# EasyEDA Pro project Temp_Con_V116.eprj, board TC_485
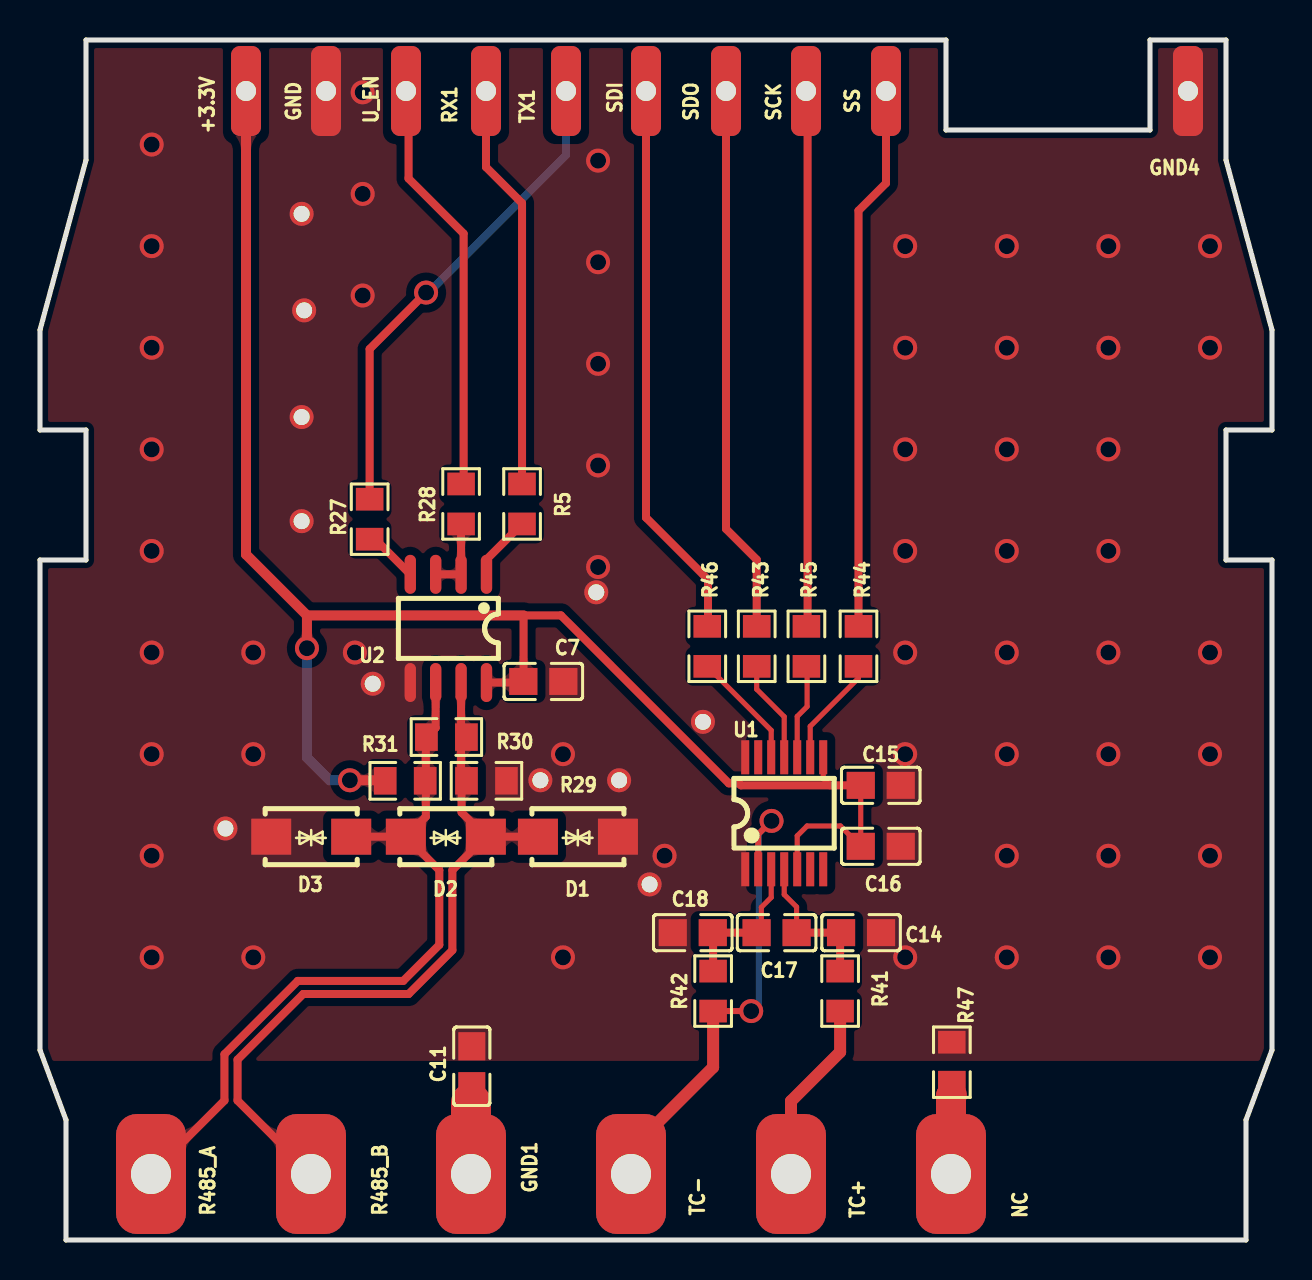
[diagram p12: board, top side]
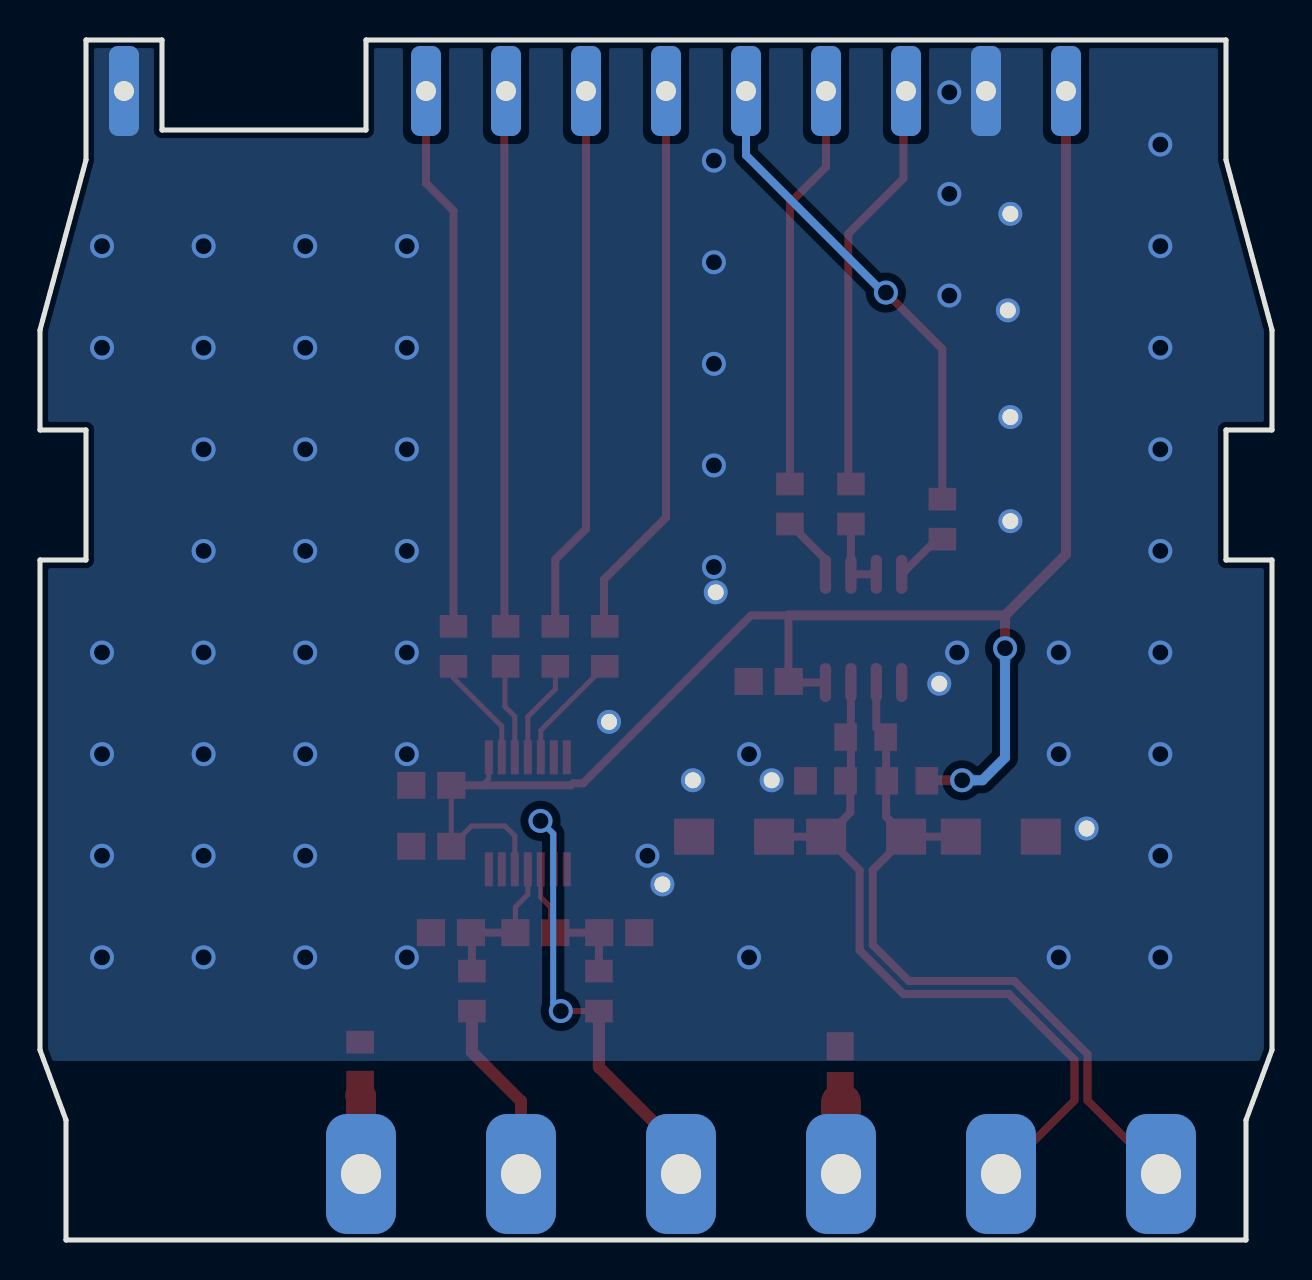
[diagram p13: board, bottom side, seen from below]

Outline 61.6 x 60 mm; copper layers: Top Layer, Bottom Layer. Coordinates in mm from the lower left corner of the outline.
Outline path: 0,45.5 0,40.5 2.3,40.5 2.3,34 0,34 0,9.5 1.3,6 1.3,0 60.3,0 60.3,6 61.6,9.5 61.6,34 59.3,34 59.3,40.5 61.6,40.5 61.6,45.5 59.3,54 59.3,60 55.5,60 55.5,55.5 45.3,55.5 45.3,60 2.3,60 2.3,54 0,45.5
Stack: Top Layer 0.035mm / Dielectric1 1.51mm FR4 er 4.5 / Bottom Layer 0.035mm

## Design rules (mm)
net R485_B: DP1
net R485_A: DP1
template: Custom Config
spacing copperThickness1oz (default): track to track 0.254, other pairs 0.203 to 0.305
spacing copperThickness2oz: track to track 0.203, other pairs 0.152 to 0.3
track width copperThickness1oz (default): min 0.127, default 0.254, max 2.54
track width copperThickness2oz: min 0.203, default 0.254, max 2.54
differential pair differentialPair (default): width min 0.254, default 0.4, max 2.54; gap min 0.254, default 0.254
via viaSize (default): diameter min 0.5, default 1.2, max 10; hole min 0.3, default 0.8, max 6.299

## Placement (name value [footprint] x y rotation side)
+3.3V  -  [S_FT]  10.3 57.45 0 top
C7  100nF  [C0805]  25.17 27.93 180 top
C11  1nF  [C0805]  21.59 8.69 90 top
C14  10nF  [C0805]  41.05 15.37 180 top
C15  100nF  [C0805]  42.04 22.73 0 top
C16  100nF  [C0805]  42.04 19.69 0 top
C17  100nF  [C0805]  36.83 15.37 180 top
C18  10nF  [C0805]  32.64 15.37 0 top
D1  SMAJ12CA  [SMA_L4.4-W2.6-LS5.0-BI]  26.9 20.17 0 top
D2  SMAJ12CA  [SMA_L4.4-W2.6-LS5.0-BI]  20.29 20.17 0 top
D3  SMAJ12CA  [SMA_L4.4-W2.6-LS5.0-BI]  13.56 20.17 0 top
GND  -  [S_FT]  14.3 57.45 0 top
GND1  -  [B_FT]  21.55 3.3 180 top
GND4  -  [S_FT]  57.4 57.45 180 top
NC  -  [B_FT]  45.55 3.3 180 top
NOREF  -  [Pad_e283]  28.96 22.99 0 top
NOREF#2  -  [Pad_e877]  13.08 51.31 0 top
NOREF#3  -  [Pad_e867]  30.48 17.78 0 top
NOREF#4  -  [Pad_e866]  25.02 22.99 0 top
NOREF#5  -  [Pad_e874]  13.21 46.48 0 top
NOREF#6  -  [Pad_e870]  27.81 32.39 0 top
NOREF#7  -  [Pad_e875]  13.08 41.15 0 top
NOREF#8  -  [Pad_e872]  16.64 27.81 0 top
NOREF#9  -  [Pad_e868]  33.15 25.91 0 top
NOREF#10  -  [Pad_e876]  13.08 35.94 0 top
NOREF#11  -  [Pad_e863]  9.27 20.57 0 top
R5  1kΩ  [R0805]  24.1 36.8 270 top
R27  1kΩ  [R0805]  16.48 36.04 270 top
R28  1kΩ  [R0805]  21.05 36.8 270 top
R29  4.7kΩ  [R0805]  22.32 22.96 0 top
R30  120Ω  [R0805]  20.32 25.15 0 top
R31  4.7kΩ  [R0805]  18.26 22.96 0 top
R41  100Ω  [R0805]  40 12.45 270 top
R42  100Ω  [R0805]  33.66 12.45 270 top
R43  0Ω  [R0805]  35.84 29.68 270 top
R44  0Ω  [R0805]  40.93 29.68 270 top
R45  0Ω  [R0805]  38.32 29.68 270 top
R46  0Ω  [R0805]  33.36 29.68 270 top
R47  0Ω  [R0805]  45.59 8.89 270 top
R485_A  -  [B_FT]  5.55 3.3 180 top
R485_B  -  [B_FT]  13.55 3.3 180 top
RX1  -  [S_FT]  22.3 57.45 180 top
SCK  -  [S_FT]  38.3 57.45 180 top
SDI  -  [S_FT]  30.3 57.45 180 top
SDO  -  [S_FT]  34.3 57.45 180 top
SS  -  [S_FT]  42.3 57.45 180 top
TC+  -  [B_FT]  37.55 3.3 180 top
TC-  -  [B_FT]  29.55 3.3 180 top
TX1  -  [S_FT]  26.3 57.45 180 top
U1  MAX31856MUD+T  [TSSOP-14_L5.0-W4.4-P0.65-LS6.4-BL]  37.21 21.34 0 top
U2  SP3485EN-L/TR  [SOIC-8_L5.0-W4.0-P1.27-LS6.0-BL]  20.42 30.58 180 top
U_EN  -  [S_FT]  18.3 57.45 180 top

## Footprints (pads in the part's own frame, mm; a bottom-side part is the same pattern mirrored in y, then rotated)
B_FT
  rrect 3.5x6 hole 2x1.5: 1(0,0)
C0805
  rect 1.41x1.35 smd: 1(-1,0) 2(1,0)
Pad_e283
  round 1.2 hole 0.8: 1(0,0)
Pad_e863
  round 1.2 hole 0.8: 1(0,0)
Pad_e866
  round 1.2 hole 0.8: 1(0,0)
Pad_e867
  round 1.2 hole 0.8: 1(0,0)
Pad_e868
  round 1.2 hole 0.8: 1(0,0)
Pad_e870
  round 1.2 hole 0.8: 1(0,0)
Pad_e872
  round 1.2 hole 0.8: 1(0,0)
Pad_e874
  round 1.2 hole 0.8: 1(0,0)
Pad_e875
  round 1.2 hole 0.8: 1(0,0)
Pad_e876
  round 1.2 hole 0.8: 1(0,0)
Pad_e877
  round 1.2 hole 0.8: 1(0,0)
R0805
  rect 1.133x1.377 smd: 1(-1,0) 2(1,0)
S_FT
  rrect 1.5x4.5 hole 1: 1(0,0)
SMA_L4.4-W2.6-LS5.0-BI
  rect 2x1.8 smd: 1(-2,0) 2(2,0)
SOIC-8_L5.0-W4.0-P1.27-LS6.0-BL
  oval 0.569x1.95 smd: 1(-1.905,-2.705) 2(-0.635,-2.705) 3(0.635,-2.705) 4(1.905,-2.705) 5(1.905,2.705) 6(0.635,2.705) 7(-0.635,2.705) 8(-1.905,2.705)
TSSOP-14_L5.0-W4.4-P0.65-LS6.4-BL
  rect 0.4x1.7 smd: 1(-1.95,-2.8) 2(-1.3,-2.8) 3(-0.65,-2.8) 4(0,-2.8) 5(0.65,-2.8) 6(1.3,-2.8) 7(1.95,-2.8) 8(1.95,2.8) 9(1.3,2.8) 10(0.65,2.8) 11(0,2.8) 12(-0.65,2.8) 13(-1.3,2.8) 14(-1.95,2.8)

## Nets
As in the schematic, except:
GND: C7.1 C11.2 C14.1 C15.2 C16.2 C18.1 D1.2 D3.1 GND.1 GND4.1 NOREF.1 NOREF#2.1 NOREF#3.1 NOREF#4.1 NOREF#5.1 NOREF#6.1 NOREF#7.1 NOREF#8.1 NOREF#9.1 NOREF#10.1 NOREF#11.1 R29.2 R47.1 U1.1 U1.14 U2.5

Pads without a net: U1 6 13

## Via types
v1: diameter 1.2, hole 0.8, Top Layer to Bottom Layer, 58 vias

## Routing (per net, layer and track width the routed paths; a pad name or vN(x,y) marks a point on that pad's centre or on a via; arc(x,y) is an arc through that point)
+3.3V: length 85.4
  Top Layer w0.254: U1.8 39.16,23.07 39.5,22.73 ; C15.1 C16.1 40.02,20.7 38.35,20.7 37.86,20.21 37.86,18.54
  Top Layer w0.4: U2.8 24.11,27.87 C7.2 24.18,27.94 24.18,31.23 26.05,31.23 34.44,22.83 34.95,22.83 35.05,22.73 C15.1
  Top Layer w0.5: R31.1 17.23,22.99 v1(15.49,22.99) ; 13.35,31.23 v1(13.35,29.59) ; 13.35,31.23 24.18,31.23 ; 13.35,31.23 10.3,34.28 +3.3V.1
  Bottom Layer w0.5: v1(13.35,29.59) 13.35,24.12 14.48,22.99 v1(15.49,22.99)
GND:
  vias: v1(5.58,54.77) v1(5.58,49.69) v1(5.58,44.61) v1(5.58,39.53) v1(5.58,34.45) v1(5.58,29.37) v1(5.58,24.29) v1(5.58,19.21) v1(5.58,14.13) v1(10.66,29.37) v1(10.66,24.29) v1(10.66,14.13) v1(15.74,29.37) v1(16.13,57.38) v1(16.13,52.3) v1(16.13,47.22) v1(26.15,24.29) v1(26.15,14.13) v1(27.9,53.97) v1(27.9,48.89) v1(27.9,43.81) v1(27.9,38.73) v1(27.9,33.65) v1(31.23,19.21) v1(43.26,49.69) v1(43.26,44.61) v1(43.26,39.53) v1(43.26,34.45) v1(43.26,29.37) v1(43.26,24.29) v1(43.26,14.13) v1(48.34,49.69) v1(48.34,44.61) v1(48.34,39.53) v1(48.34,34.45) v1(48.34,29.37) v1(48.34,24.29) v1(48.34,19.21) v1(48.34,14.13) v1(53.42,49.69) v1(53.42,44.61) v1(53.42,39.53) v1(53.42,34.45) v1(53.42,29.37) v1(53.42,24.29) v1(53.42,19.21) v1(53.42,14.13) v1(58.5,49.69) v1(58.5,44.61) v1(58.5,29.37) v1(58.5,24.29) v1(58.5,19.21) v1(58.5,14.13)
GND1: length 3.6
  Top Layer w2: GND1.1 21.55,6.86
R485_A: length 37.7
  Top Layer w0.4: D2.1 19.97,18.49 19.97,14.76 18.16,12.95 12.89,12.95 9.22,9.29 9.22,6.97 R485_A.1 ; D2.1 19.29,21.17 19.29,25.12 19.78,25.61 U2.6 ; D2.1 D3.2
R485_B: length 37.6
  Top Layer w0.4: R485_B.1 9.88,6.97 9.88,9.02 13.16,12.3 18.43,12.3 20.62,14.49 20.62,18.49 D2.2 ; U2.7 21.05,23.23 R29.1 21.08,22.72 21.08,21.37 D2.2 ; D2.2 D1.1
SCLK: length 26.8
  Top Layer w0.4: SCK.1 38.38,57.37 38.38,30.74 R45.1
SDI: length 28.1
  Top Layer w0.4: SDI.1 30.3,36.12 33.4,33.02 33.4,30.72 R46.1
SDO: length 27.4
  Top Layer w0.4: R43.1 35.84,34.02 34.3,35.56 SDO.1
SS: length 27.3
  Top Layer w0.4: R44.1 40.93,51.47 42.3,52.84 SS.1
THERM+: length 9.2
  Top Layer w0.6: TC+.1 37.55,6.94 40,9.4 R41.2
THERM-: length 24.5
  Top Layer w0.3: U1.2 35.91,20.29 v1(36.58,20.95) ; R42.2 v1(35.56,11.45)
  Top Layer w0.6: 33.91,11.45 33.66,11.19 33.66,8.64 29.55,4.53 TC-.1
  Bottom Layer w0.3: v1(36.58,20.95) 35.94,20.32 35.94,11.83 v1(35.56,11.45)
U1_EN: length 20.9
  Top Layer w0.4: R28.1 21.18,37.93 21.18,50.32 18.43,53.07 18.43,57.32 U_EN.1
U1_RX: length 20.4
  Top Layer w0.4: RX1.1 22.3,53.65 24.1,51.84 R5.1
U1_TX: length 24.6
  Top Layer w0.4: R27.1 16.48,44.55 v1(19.3,47.37)
  Bottom Layer w0.4: v1(19.3,47.37) 19.43,47.37 26.3,54.24 TX1.1
$2N3925: length 4
  Top Layer w1.5: NC.1 45.55,7.2 45.59,7.24
$2N8941: length 7.6
  Top Layer w0.254: C17.1 37.83,16.65 37.21,17.27 U1.4
  Top Layer w0.4: C17.1 C14.2 40,15.32 R41.1
$2N8947: length 7.5
  Top Layer w0.254: 35.81,15.38 C17.2 ; U1.3 36.56,17.13 36.07,16.64 36.07,15.38
  Top Layer w0.4: R42.1 33.66,15.35 C18.2 C17.2
$2N8951: length 5.1
  Top Layer w0.254: R43.2 35.84,27.54 37.21,26.16 U1.11
$2N8952: length 5.9
  Top Layer w0.254: R46.2 36.56,25.48 U1.12
$2N8954: length 5.5
  Top Layer w0.254: R44.2 40.93,28.1 38.51,25.68 U1.9
$2N8955: length 4.8
  Top Layer w0.254: R45.2 38.35,28.65 38.35,26.67 37.86,26.18 37.86,24.14
$3N638: length 3.3
  Top Layer w0.4: U2.1 22.32,34.02 R5.2
$3N639: length 3.8
  Top Layer w0.4: R28.2 U2.2 U2.3
$3N640: length 2.8
  Top Layer w0.4: U2.4 16.76,35.04 R27.2

## Copper pours and planes (outline as drawn; the poured copper is in the pictures)
GND on Top Layer: 0,40.5 2.3,40.5 2.3,34 0,34 0,8.95 61.6,8.95 61.6,34 59.3,34 59.3,40.5 61.6,40.5 61.6,45.5 59.3,54 59.3,60 55.5,60 55.5,55.5 45.3,55.5 45.3,60 2.3,60 2.3,54 0,45.5
GND on Bottom Layer: 0,40.5 2.3,40.5 2.3,34 0,34 0,8.95 61.6,8.95 61.6,34 59.3,34 59.3,40.5 61.6,40.5 61.6,45.5 59.3,54 59.3,60 55.5,60 55.5,55.5 45.3,55.5 45.3,60 2.3,60 2.3,54 0,45.5

Small or netless copper shapes (teardrops, artwork), in the pictures only: 31 on Top Layer, 2 on Bottom Layer
